# Altium schematic sheet Filter2.SchDoc
size 420 x 297 mm; SheetNumber: 7; SheetTotal: 13
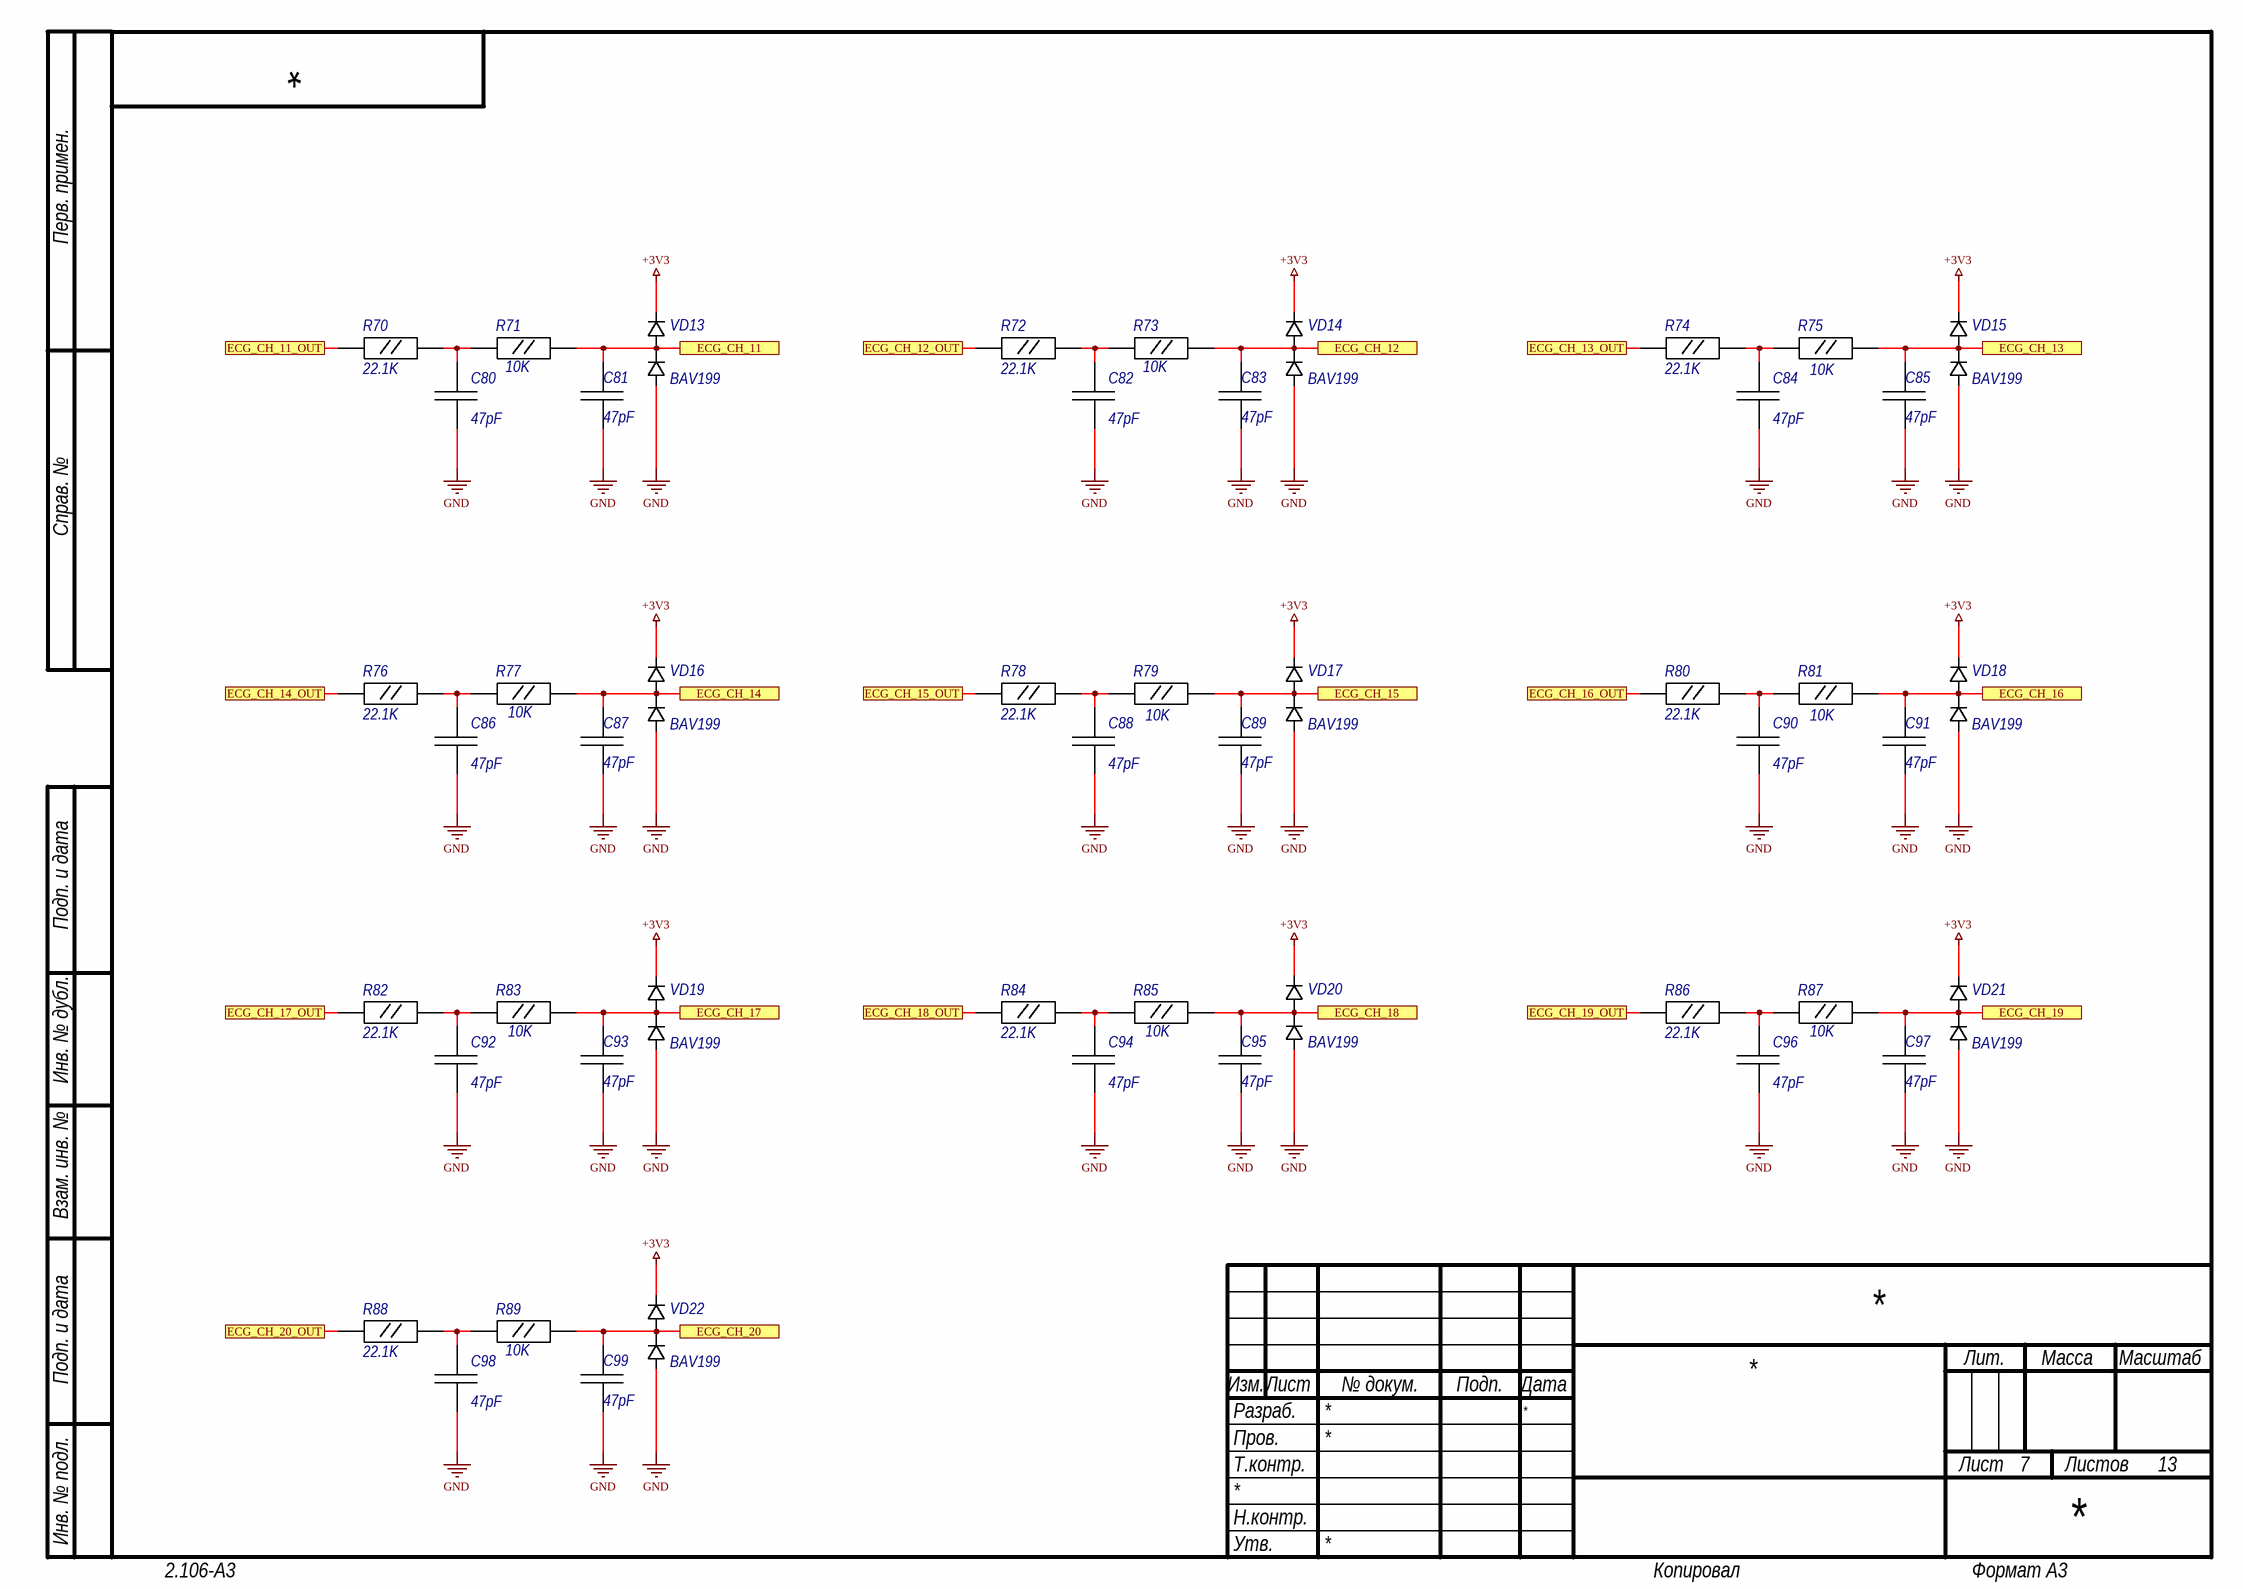
[diagram p0: Filter2.SchDoc]

## Parts
C80  47pF  [C0603]
C81  47pF  [C0603]
C82  47pF  [C0603]
C83  47pF  [C0603]
C84  47pF  [C0603]
C85  47pF  [C0603]
C86  47pF  [C0603]
C87  47pF  [C0603]
C88  47pF  [C0603]
C89  47pF  [C0603]
C90  47pF  [C0603]
C91  47pF  [C0603]
C92  47pF  [C0603]
C93  47pF  [C0603]
C94  47pF  [C0603]
C95  47pF  [C0603]
C96  47pF  [C0603]
C97  47pF  [C0603]
C98  47pF  [C0603]
C99  47pF  [C0603]
R70  22.1K  [R0603]
R71  10K  [R0603]
R72  22.1K  [R0603]
R73  10K  [R0603]
R74  22.1K  [R0603]
R75  10K  [R0603]
R76  22.1K  [R0603]
R77  10K  [R0603]
R78  22.1K  [R0603]
R79  10K  [R0603]
R80  22.1K  [R0603]
R81  10K  [R0603]
R82  22.1K  [R0603]
R83  10K  [R0603]
R84  22.1K  [R0603]
R85  10K  [R0603]
R86  22.1K  [R0603]
R87  10K  [R0603]
R88  22.1K  [R0603]
R89  10K  [R0603]
VD13  BAV199  [SOT23]
VD14  BAV199  [SOT23]
VD15  BAV199  [SOT23]
VD16  BAV199  [SOT23]
VD17  BAV199  [SOT23]
VD18  BAV199  [SOT23]
VD19  BAV199  [SOT23]
VD20  BAV199  [SOT23]
VD21  BAV199  [SOT23]
VD22  BAV199  [SOT23]

## Ports
ECG_CH_11, ECG_CH_11_OUT, ECG_CH_12, ECG_CH_12_OUT, ECG_CH_13, ECG_CH_13_OUT, ECG_CH_14, ECG_CH_14_OUT, ECG_CH_15, ECG_CH_15_OUT, ECG_CH_16, ECG_CH_16_OUT, ECG_CH_17, ECG_CH_17_OUT, ECG_CH_18, ECG_CH_18_OUT, ECG_CH_19, ECG_CH_19_OUT, ECG_CH_20, ECG_CH_20_OUT

## Nets
+3V3: VD13.2 VD14.2 VD15.2 VD16.2 VD17.2 VD18.2 VD19.2 VD20.2 VD21.2 VD22.2
GND: C80.1 C81.1 C82.1 C83.1 C84.1 C85.1 C86.1 C87.1 C88.1 C89.1 C90.1 C91.1 C92.1 C93.1 C94.1 C95.1 C96.1 C97.1 C98.1 C99.1 VD13.1 VD14.1 VD15.1 VD16.1 VD17.1 VD18.1 VD19.1 VD20.1 VD21.1 VD22.1
ECG_CH_11: C81.2 R71.2 VD13.3 ; port ECG_CH_11
ECG_CH_11_OUT: R70.1 ; port ECG_CH_11_OUT
ECG_CH_12: C83.2 R73.2 VD14.3 ; port ECG_CH_12
ECG_CH_12_OUT: R72.1 ; port ECG_CH_12_OUT
ECG_CH_13: C85.2 R75.2 VD15.3 ; port ECG_CH_13
ECG_CH_13_OUT: R74.1 ; port ECG_CH_13_OUT
ECG_CH_14: C87.2 R77.2 VD16.3 ; port ECG_CH_14
ECG_CH_14_OUT: R76.1 ; port ECG_CH_14_OUT
ECG_CH_15: C89.2 R79.2 VD17.3 ; port ECG_CH_15
ECG_CH_15_OUT: R78.1 ; port ECG_CH_15_OUT
ECG_CH_16: C91.2 R81.2 VD18.3 ; port ECG_CH_16
ECG_CH_16_OUT: R80.1 ; port ECG_CH_16_OUT
ECG_CH_17: C93.2 R83.2 VD19.3 ; port ECG_CH_17
ECG_CH_17_OUT: R82.1 ; port ECG_CH_17_OUT
ECG_CH_18: C95.2 R85.2 VD20.3 ; port ECG_CH_18
ECG_CH_18_OUT: R84.1 ; port ECG_CH_18_OUT
ECG_CH_19: C97.2 R87.2 VD21.3 ; port ECG_CH_19
ECG_CH_19_OUT: R86.1 ; port ECG_CH_19_OUT
ECG_CH_20: C99.2 R89.2 VD22.3 ; port ECG_CH_20
ECG_CH_20_OUT: R88.1 ; port ECG_CH_20_OUT
NetC80_2: C80.2 R70.2 R71.1
NetC82_2: C82.2 R72.2 R73.1
NetC84_2: C84.2 R74.2 R75.1
NetC86_2: C86.2 R76.2 R77.1
NetC88_2: C88.2 R78.2 R79.1
NetC90_2: C90.2 R80.2 R81.1
NetC92_2: C92.2 R82.2 R83.1
NetC94_2: C94.2 R84.2 R85.1
NetC96_2: C96.2 R86.2 R87.1
NetC98_2: C98.2 R88.2 R89.1

## Notes on the sheet
- Перв. примен.
- Справ. №
- Подп. и дата
- Инв. № дубл.
- Взам. инв. №
- Разраб.
- Изм.
- Лист
- № докум.
- Подп.
- Дата
- Лит.
- Масса
- Масштаб
- Пров.
- Т.контр.
- Листов
- Инв. № подл.
- Утв.
- Н.контр.
- 2.106-A3
- Копировал
- Формат А3

## Library data of the parts
C80-C99 = CC_SMD_0603: Ceramic Capacitor SMD; Package: 0603; Value: 47pF
R70-R89 = R0603: Resistor SMD
  R70 R72 R74 R76 R78 R80 R82 R84 R86 R88: Value: 22.1K
  R71 R73 R75 R77 R79 R81 R83 R85 R87 R89: Value: 10K
VD13-VD22 = DIODE_BAV199: Diod Schottky; Diode Type: Standard; Package: SOT-23; PartNumber: BAV199; Manufacturer Part Number 1: BAV199